# EAGLE design Carriage Board V2 (EAGLE 9.1.3)
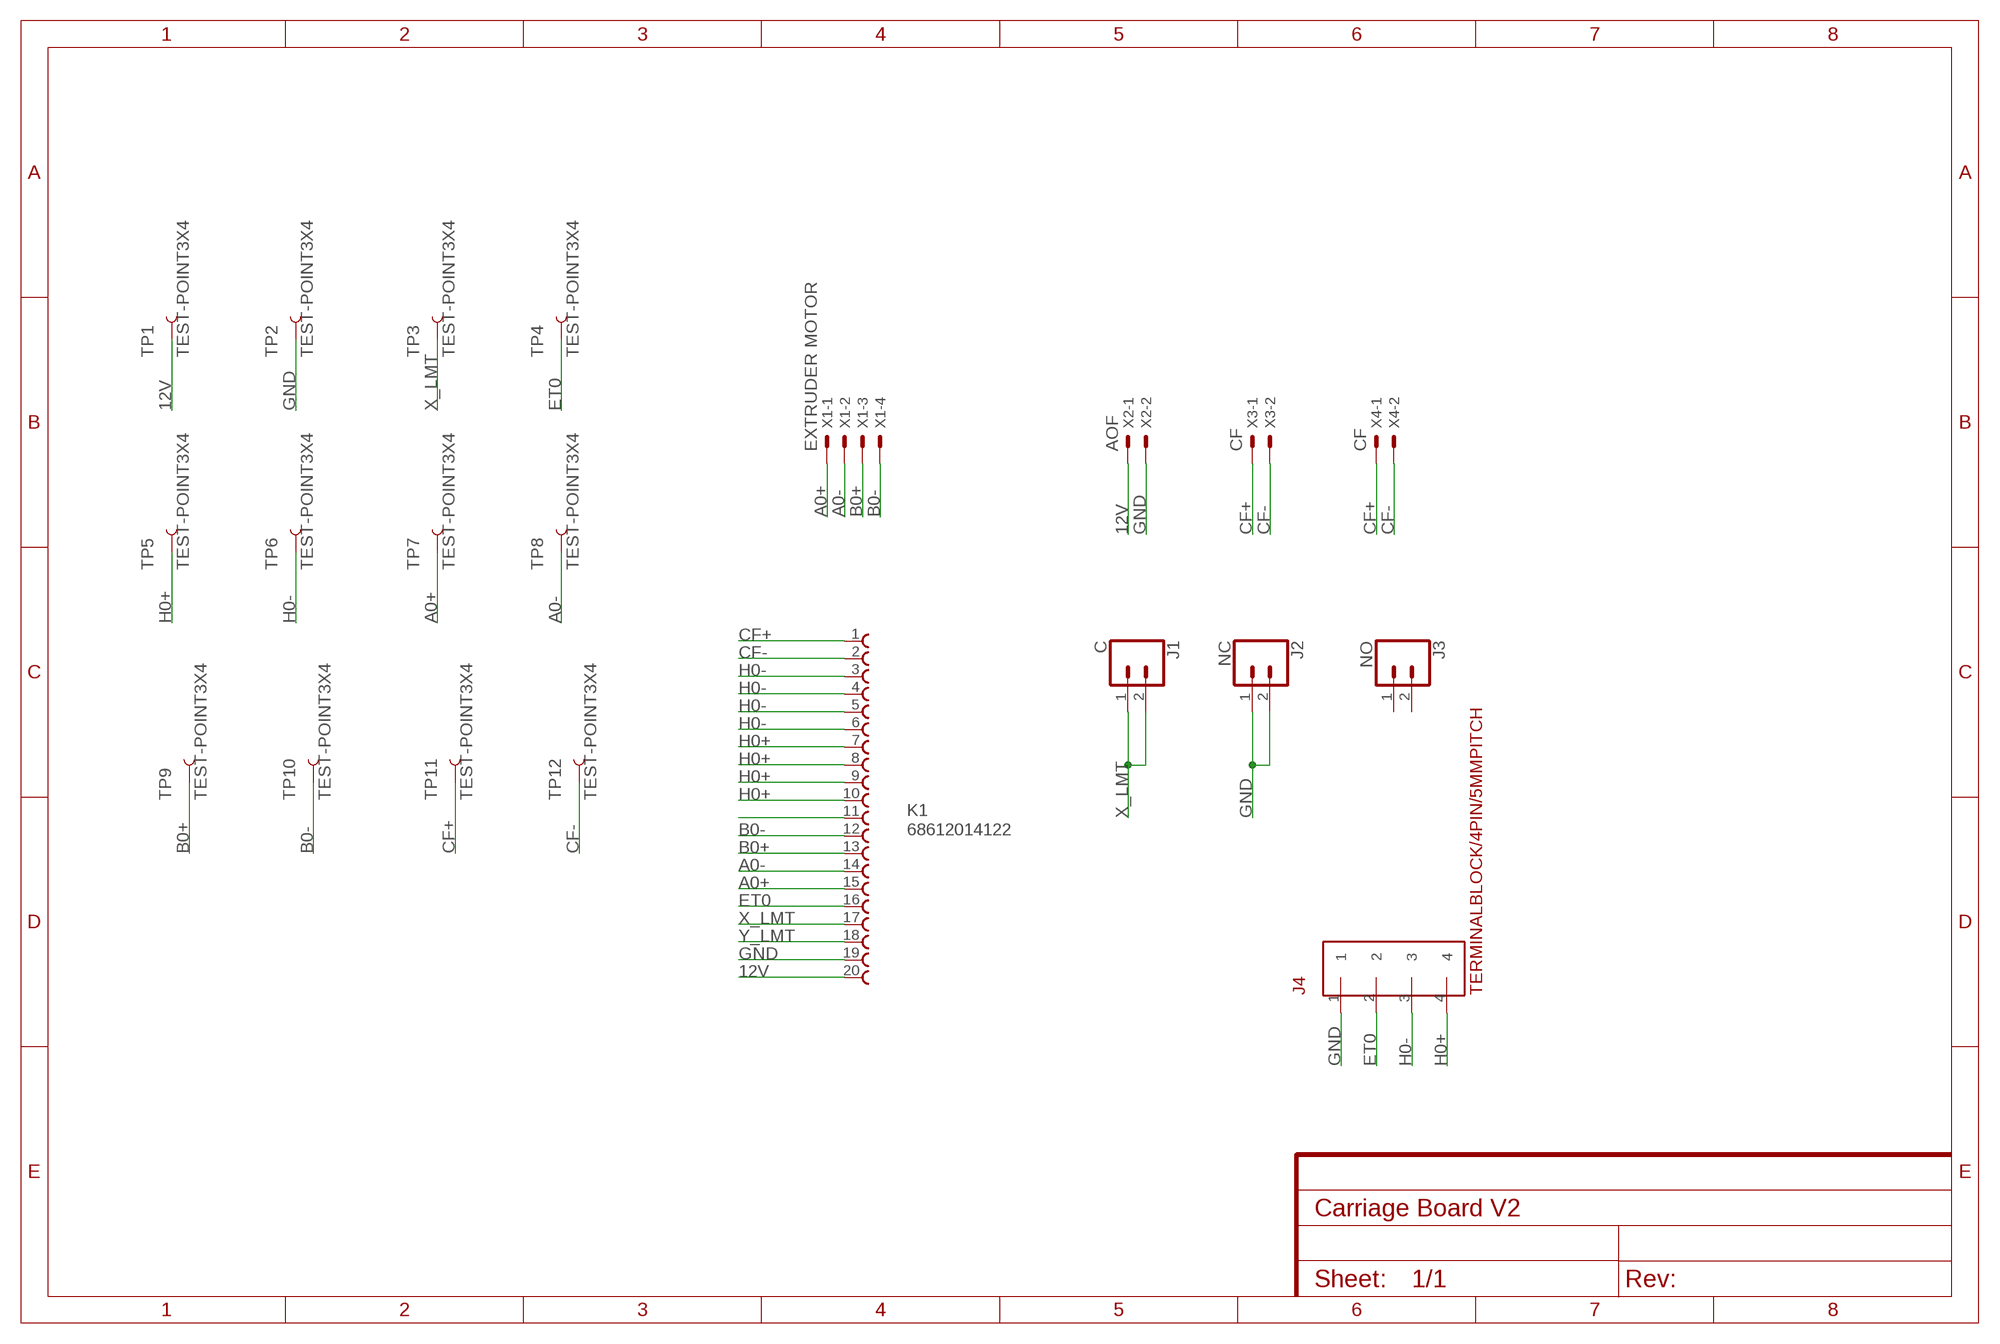
[diagram p0: schematic, sheet 1]

## Parts
J1  C  CONN_02  [1X02]
J2  NC  CONN_02  [1X02]
J3  NO  CONN_02  [1X02]
J4  TERMINALBLOCK/4PIN/5MMPITCH  [TERMINALBLOCK/TOYO/4PIN/5MMPITCH]
K1  68612014122  [68612014122]
TP1  TEST-POINT3X4  [PAD.03X.04]
TP2  TEST-POINT3X4  [PAD.03X.04]
TP3  TEST-POINT3X4  [PAD.03X.04]
TP4  TEST-POINT3X4  [PAD.03X.04]
TP5  TEST-POINT3X4  [PAD.03X.04]
TP6  TEST-POINT3X4  [PAD.03X.04]
TP7  TEST-POINT3X4  [PAD.03X.04]
TP8  TEST-POINT3X4  [PAD.03X.04]
TP9  TEST-POINT3X4  [PAD.03X.04]
TP10  TEST-POINT3X4  [PAD.03X.04]
TP11  TEST-POINT3X4  [PAD.03X.04]
TP12  TEST-POINT3X4  [PAD.03X.04]
X1  EXTRUDER MOTOR  JST-XH-04-PIN-LONG-PAD  [JST-XH-04-PACKAGE-LONG-PAD]
X2  AOF  JST-XH-02-PIN-LONG-PAD  [JST-XH-02-PACKAGE-LONG-PAD]
X3  CF  JST-XH-02-PIN-LONG-PAD  [JST-XH-02-PACKAGE-LONG-PAD]
X4  CF  JST-XH-02-PIN-LONG-PAD  [JST-XH-02-PACKAGE-LONG-PAD]

## Nets
12V: K1.20 TP1.P$1 X2.1
A0+: K1.15 TP7.P$1 X1.1
A0-: K1.14 TP8.P$1 X1.2
B0+: K1.13 TP9.P$1 X1.3
B0-: K1.12 TP10.P$1 X1.4
CF+: K1.1 TP11.P$1 X3.1 X4.1
CF-: K1.2 TP12.P$1 X3.2 X4.2
ET0: J4.2 K1.16 TP4.P$1
GND: J2.1 J2.2 J4.1 K1.19 TP2.P$1 X2.2
H0+: J4.4 K1.7 K1.8 K1.9 K1.10 TP5.P$1
H0-: J4.3 K1.3 K1.4 K1.5 K1.6 TP6.P$1
N$10: K1.11
X_LMT: J1.1 J1.2 K1.17 TP3.P$1
Y_LMT: K1.18
Unconnected: J3.1 J3.2

## Library data of the parts
J1-J3 = SparkFun-Connectors:CONN_02: Multi connection point. Often used as Generic Header-pin footprint for 0.1 inch spaced/style header connections On any of the 0.1 inch spaced packages, you can populate with these: Break Away Headers - Straight <https://www.sparkfun.com/products/116> (PRT-00116) Break Away Male Headers - Right Angle <https://www.sparkfun.com/products/553> (PRT-00553) Female Headers <https://www.sparkfun.com/products/115> (PRT-00115) Break Away Headers - Machine Pin <https://www.sparkfun.com/products/117> (PRT-00117) Break Away Female Headers - Swiss Machine Pin <https://www.sparkfun.com/products/743> (PRT-00743) For SCREWTERMINALS and SPRING TERMINALS visit here: Screw Terimnals on SparkFun.com <https://www.sparkfun.com/search/results?term=Screw+Terminals> (5mm/3.5mm/2.54mm spacing) This device is also useful as a general connection point to wire up your design to another part of your project. Our various solder wires solder well into these plated through hole pads. Hook-Up Wire - Assortment (Stranded, 22 AWG) <https://www.sparkfun.com/products/11375> (PRT-11375) Hook-Up Wire - Assortment (Solid Core, 22 AWG) <https://www.sparkfun.com/products/11367> (PRT-11367) View the entire wire category on our website here <https://www.sparkfun.com/categories/141> Special notes: Molex polarized connector foot print use with: PRT-08233 with associated crimp pins and housings. 2.54_SCREWTERM for use with PRT-10571. 3.5mm Screw Terminal footprints for PRT-08084 5mm Screw Terminal footprints for use with PRT-08432
J4 = FracktalWorks_Eagle_Library:TERMINALBLOCK/4PIN/5MMPITCH
K1 = Wurth_Elektronik_Electromechanic_FPC_Connectors_&_Flat_Flexible_Cable_rev15b:68612014122: WR-FPC 1.00mm SMT ZIF Horizontal Top Contact, 20 Pins=>Code : Con_FPC_ZIF_1.00_68612014122 <http://katalog.we-online.de/media/images/eican/Con_FPC_ZIF_1.00_6861xx14122_pf2.jpg> Details see: http://katalog.we-online.de/en/em/686_1xx_141_22 Created 2014-07-09, Karrer Zheng 2014 (C) Würth Elektronik
TP1-TP12 = SparkFun-Connectors:TEST-POINT: SparkFun Test Points Bare copper test points for troubleshooting or In-Circuit-Testing. These are used by our Production team for verifying production board runs using pogo-pins on test beds. SparkFun Products: SparkFun LSM9DS1 Breakout <https://www.sparkfun.com/products/13284> SparkFun PSOC <https://www.sparkfun.com/products/13714> SparkFun Load Cell Amplifier <https://www.sparkfun.com/products/13879>
X1 = Rembrandt Electronics - JST XH Connectors v1-0:JST-XH-04-PIN: JST XH Connector 2 Pin Wire to board connector. Pitch: 2,54 mm, (0.100") Number of pins: 4 Created by Rembrandt Electronics www.rembrandtelectronics.com
X2-X4 = Rembrandt Electronics - JST XH Connectors v1-0:JST-XH-02-PIN: JST XH Connector 2 Pin Wire to board connector. Pitch: 2,54 mm, (0.100") Number of pins: 2 Created by Rembrandt Electronics www.rembrandtelectronics.com

## Net classes
0 default: width 0.305 mm

## Board
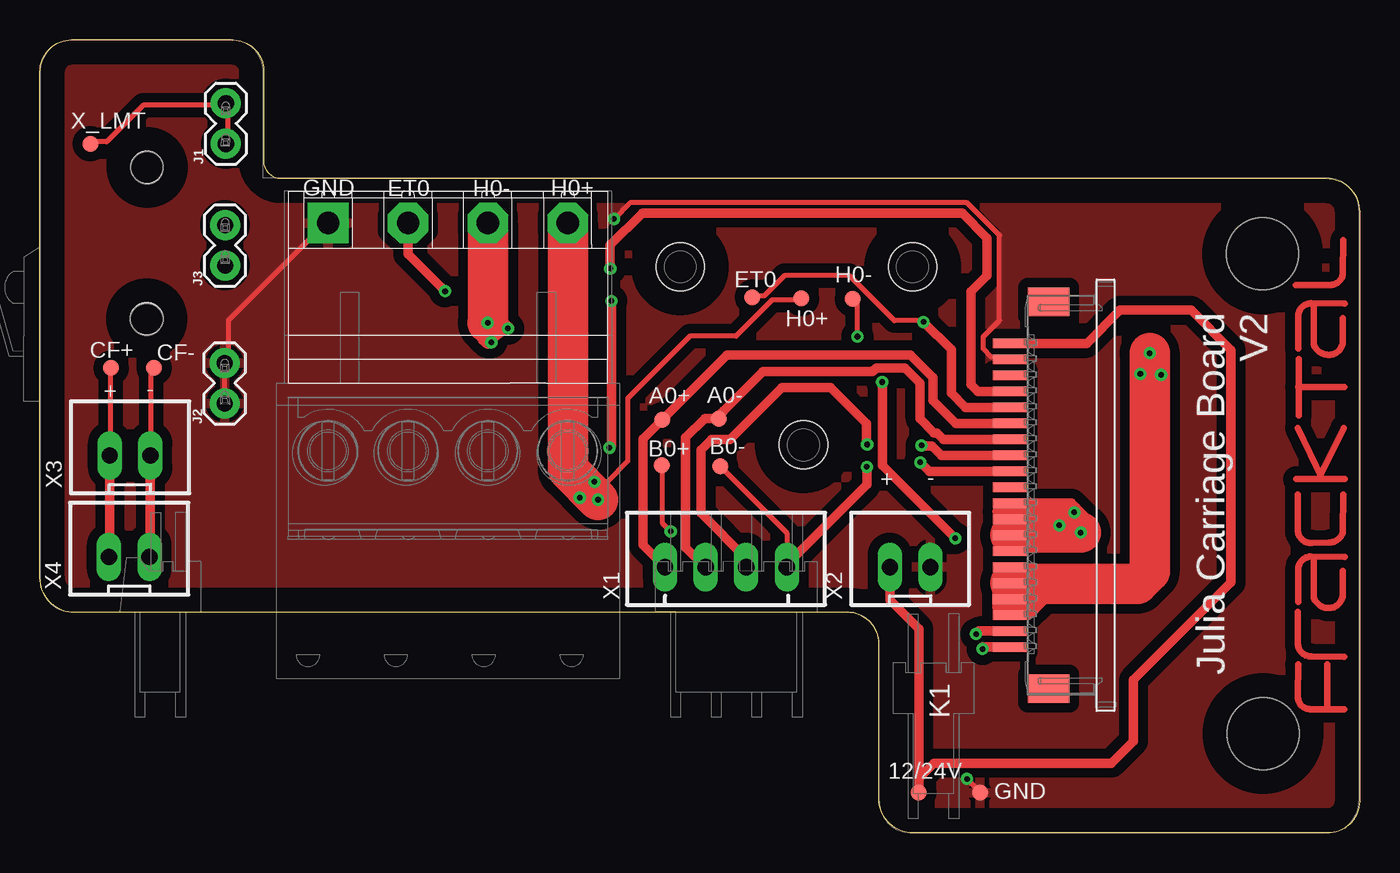
[diagram p1: board, top side]
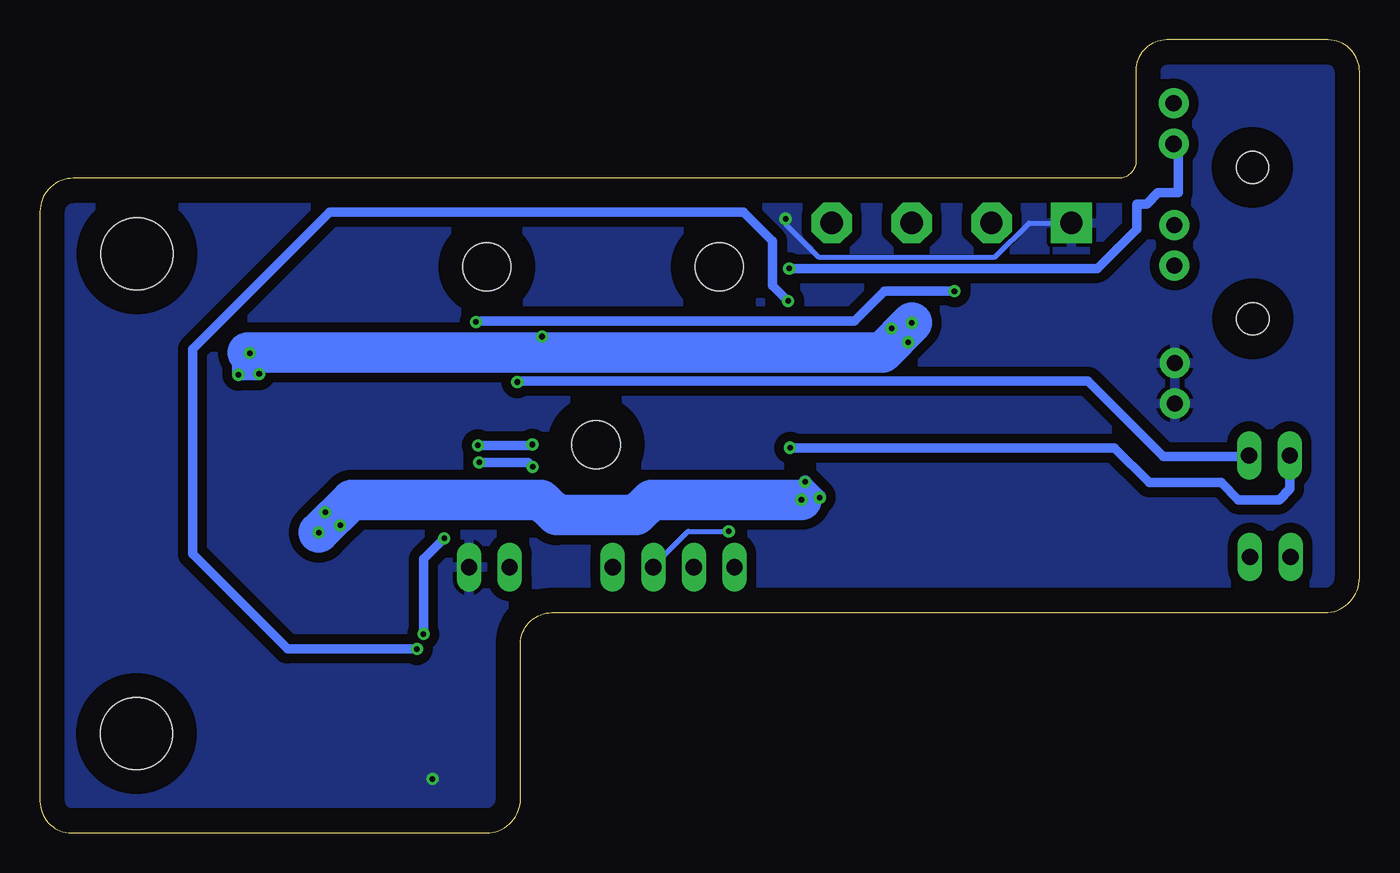
[diagram p2: board, bottom side, seen from below]

Size 82.58 x 49.63 mm. Coordinates in mm from the lower left corner, seen from the top.
Outline: 1.96,49.63 12.09,49.63 arc-90 14,47.7 14,42.06 arc90 15.09,40.97 80.49,40.97 arc-90 82.58,38.89 82.58,1.98 arc-90 80.59,0 54.64,0 arc-90 52.5,2.13 52.5,11.84 arc90 50.55,13.79 2.18,13.79 arc-90 0,15.98 0,47.65 arc-90 1.96,49.63
Copper layers (1*16): Top 0.035mm / dielectric 1.5mm / Bottom 0.035mm
Design rules "LionCircuits": minimum track width 8mil, minimum drill 0.35mm, track to track 8mil, track to pad 8mil, pad to pad 8mil, via to via 8mil, smd to smd 8mil, copper to edge 60mil, drill to drill 10mil, minimum pad ring 10mil, minimum via ring 8mil, stop-mask expansion 4mil, vias tented up to drill 0mil, thermal gap 10mil
Holes 3 mm at 40.06,35.43 54.61,35.43 47.78,24.31
Holes 2 mm at 6.71,41.66 6.68,32.18
Holes 4.5 mm at 76.5,36.25 76.53,6.22

### Footprints (pad centres in the part's own frame; a part is rotated, then mirrored left to right if it is on the bottom)
1X02 = drill 1.016 pad 1.88: 1 0,0; 2 2.54,0
TERMINALBLOCK/TOYO/4PIN/5MMPITCH = drill 1.4 pad 2.54 square: 1 0,0 | drill 1.4 pad 2.54 octagon: 2 5,0; 3 10,0; 4 15,0
68612014122 = smd 0.6 x 2.2: 1 -9.42,1.1; 2 -8.42,1.1; 3 -7.42,1.1; 4 -6.42,1.1; 5 -5.42,1.1; 6 -4.42,1.1; 7 -3.42,1.1; 8 -2.42,1.1; 9 -1.42,1.1; 10 -0.42,1.1; 11 0.58,1.1; 12 1.58,1.1; 13 2.58,1.1; 14 3.58,1.1; 15 4.58,1.1; 16 5.58,1.1; 17 6.58,1.1; 18 7.58,1.1; 19 8.58,1.1; 20 9.58,1.1 | smd 1.8 x 2.6: Z1 -12.02,-1.3; Z2 12.18,-1.3
PAD.03X.04 = smd 1.016 x 1.016: P$1 0,0
JST-XH-04-PACKAGE-LONG-PAD = drill 1.016 long: 1 -3.81,0; 2 -1.27,0; 3 1.27,0; 4 3.81,0
JST-XH-02-PACKAGE-LONG-PAD = drill 1.016 long: 1 -1.27,0; 2 1.27,0

### Placement (x,y rotation side)
J1  11.63,43.13 90 top
J2  11.56,26.87 90 top
J3  11.58,35.51 90 top
J4  18.03,38.18 0 top
K1  61.82,21.06 90 top
TP1  54.99,2.54 0 top
TP2  58.83,2.51 0 top
TP3  3.15,43.13 0 top
TP4  44.58,33.53 0 top
TP5  47.65,33.45 0 top
TP6  50.85,33.43 0 top
TP7  38.94,25.86 0 top
TP8  42.47,25.93 0 top
TP9  38.91,23.01 0 top
TP10  42.57,22.94 0 top
TP11  4.45,29.11 0 top
TP12  7.14,29.11 0 top
U$1  [FRACKTALLOGO]  81.71,19.74 90 top
X1  42.93,16.64 0 top
X2  54.46,16.64 0 top
X3  5.64,23.62 0 top
X4  5.59,17.27 0 top

### Tracks (layer width: path | path; a pad name or v marks a point on that pad's centre or on a via)
12V
  Top 0.61: K1.20 65.51,30.64 67.59,32.72 72.03,32.72 74.52,30.23 74.52,15.67 68.43,9.58 68.43,5.74 67.06,4.37 55.96,4.37 54.99,3.4 TP1.P$1 54.99,12.78 53.19,14.59 X2.1
A0+
  Top 0.61: K1.15 57.32,25.64 55.88,27.08 55.88,28.51 54.46,29.92 43,29.92 TP7.P$1 37.74,24.66 37.74,18.01 X1.1
A0-
  Top 0.305: 42.68,26.33 42.77,26.24 42.77,26.42
  Top 0.61: K1.14 56.55,24.64 56.14,25.04 55.96,25.04 55.07,25.93 55.07,28.17 54.13,29.11 52.34,29.11 52.11,28.88 45.24,28.88 42.77,26.42 | 42.68,26.33 42.47,26.11 TP8.P$1 41.61,25.93 40.41,24.74 40.41,17.88 X1.2
B0+  (via drill 0.35)
  Top 0.305: v39.47,18.87 38.96,19.38 38.96,22.94 TP9.P$1
  Top 0.61: K1.13 56.4,23.64 55.8,24.23 55.19,24.23 v55.17,24.26 | v51.77,24.31 51.71,24.36 51.71,25.63 49.46,27.89 46.43,27.89 43.17,24.64 42.01,24.64 41.35,23.98 41.35,20.02 44.2,17.17 X1.3
  Bottom 0.305: v39.47,18.87 42.01,18.87 44.04,16.84 X1.3
  Bottom 0.61: v55.17,24.26 51.82,24.26 v51.77,24.31
B0-  (via drill 0.35)
  Top 0.305: TP10.P$1 46.74,18.77 X1.4
  Top 0.61: K1.12 55.65,22.64 v55.09,23.19 | X1.4 46.74,16.82 51.74,21.82 v51.74,22.91
  Bottom 0.61: v55.09,23.19 52.02,23.19 v51.74,22.91
CF+  (via drill 0.35)
  Top 0.305: TP11.P$1 4.42,29.03 4.42,23.7 X3.1
  Top 0.61: X3.1 4.37,17.32 X4.1 | K1.1 58.98,11.64 v58.98,11.51 | v35.76,33.3 35.76,24.23 v35.64,24.1
  Bottom 0.61: X3.1 4.37,21.51 5.03,20.85 7.59,20.85 8.66,21.92 13.16,21.92 15.35,24.1 v35.64,24.1 | v58.98,11.51 67.08,11.51 73.02,17.45 73.02,30.28 64.44,38.86 38.55,38.86 36.73,37.04 36.73,34.26 v35.76,33.3
CF-  (via drill 0.35)
  Top 0.305: TP12.P$1 6.96,29.03 6.96,23.7 X3.2
  Top 0.61: K1.2 58.76,12.64 v58.57,12.45 | v57.28,18.44 52.7,23.01 v52.7,28.22 | X3.2 6.91,17.32 X4.2
  Bottom 0.61: v58.57,12.45 58.57,17.15 v57.28,18.44 | X3.2 6.96,23.57 12.29,23.57 17,28.27 52.65,28.27 v52.7,28.22
ET0  (via drill 0.35)
  Top 0.305: TP4.P$1 44.81,33.6 45.31,33.6 46.58,34.87 50.65,34.87 53.47,32.06 55.37,32.06 v55.3,31.98
  Top 0.61: J4.2 23.03,36.22 v25.35,33.91 | v55.3,31.98 57.02,30.25 57.02,27.53 57.92,26.64 K1.16
  Bottom 0.61: v25.35,33.91 29.72,33.91 31.6,32.03 55.24,32.03 v55.3,31.98
GND  (via drill 0.35)
  Top 0.305: J2.1 11.53,27 11.53,29.29 J2.2 11.79,29.54 11.79,32.08 17.88,38.18 J4.1 | v58.01,3.38 58.78,2.62 TP2.P$1 | v35.92,38.43 36.93,39.45 58.01,39.45 60.05,37.41 60.05,32.08 59.03,31.06 59.03,30.3 59.54,29.79 60.55,29.79 K1.19
  Bottom 0.305: J4.1 20.68,38.18 22.81,36.04 33.86,36.04 35.92,38.1 v35.92,38.43
  pour Bottom (isolate 0.61): 1.88,49.68 12.17,49.68 arc-90 14.1,47.75 14.1,42.47 arc90 15.65,40.92 79.63,40.92 arc-90 82.65,37.9 82.65,2.11 arc-90 80.42,-0.13 54.81,-0.13 arc-90 52.43,2.26 52.43,11.35 arc90 50.04,13.74 2.64,13.74 arc-90 0,16.38 0,47.75 arc-90 1.88,49.63
  pour Top (isolate 0.61): 1.7,49.66 11.73,49.66 arc-90 14.1,47.29 14.1,42.77 arc90 16.05,40.82 79.48,40.82 arc-90 82.73,37.57 82.73,2.18 arc-90 80.37,-0.18 55.27,-0.18 arc-90 52.32,2.77 52.32,11.15 arc90 49.78,13.69 3.18,13.69 arc-90 0,16.87 0,47.96 arc-90
H0+  (via drill 0.35)
  Top 0.305: TP5.P$1 47.6,33.35 45.82,33.35 43.56,31.09 40.67,31.09 36.78,27.2 36.78,23.27 35.48,21.97 v34.7,21.97
  Top 0.61: 64.83,20.36 64.55,20.64 K1.10 60.72,20.19 | 64.83,20.36 65.94,19.25 65.48,18.8 v65.13,18.8 | 60.72,20.19 K1.9 | 60.72,20.19 64.67,20.19 64.83,20.36 | 60.72,20.19 59.97,20.19 59.89,20.12 60.72,19.29 K1.7
  Top 2.54: v34.92,20.85 33.03,22.74 J4.4 | v65.13,18.8 60.88,18.8 K1.8
  Bottom 0.813: v65.13,18.8 65.13,19.66 v64.72,20.07 63.91,19.25 v63.78,19.25 | v33.78,20.98 33.78,21.06 v34.7,21.97 34.7,21.08 v34.92,20.85
  Bottom 2.54: v65.13,18.8 63.07,20.85 51.23,20.85 50.26,19.89 45.27,19.89 44.3,20.85 v34.92,20.85
H0-  (via drill 0.35)
  Top 0.305: v51.16,31.06 51.16,33.26 TP6.P$1
  Top 0.61: 62.26,14 61.9,13.64 K1.3 60.72,14.15 | 62.26,14 63.86,15.6 | 60.72,14.15 K1.4 | 60.72,14.15 62.1,14.15 62.13,14.12 | 62.26,14 62.13,14.12 | 62.13,14.12 59.87,14.12 59.87,15.78 K1.6
  Top 0.813: v28.02,31.93 28.93,31.93 v29.29,31.57 28.32,31.57 27.74,30.99 28.02,30.71 v28.24,30.71
  Top 2.54: J4.3 28.03,31.95 v28.02,31.93 | v69.44,30.02 69.44,16.36 68.68,15.6 63.86,15.6 60.76,15.6 K1.5
  Bottom 0.305: v51.16,31.06 51.16,30.07
  Bottom 0.813: v68.86,28.73 70.1,28.73 v70.15,28.68 70.15,29.31 v69.44,30.02
  Bottom 2.54: v28.02,31.93 29.87,30.07 51.16,30.07 69.57,30.07 69.52,30.02 v69.44,30.02
X_LMT  (via drill 0.35)
  Top 0.305: TP3.P$1 3.15,43.26 4.17,43.26 6.45,45.54 11.53,45.54 J1.2 11.79,45.54 11.79,43.26 J1.1
  Top 0.61: K1.17 58.7,27.64 58.27,28.07 58.27,33.88 59.26,34.87 59.26,37.24 57.71,38.79 37.69,38.79 35.69,36.78 v35.69,35.33
  Bottom 0.61: v35.69,35.33 16.41,35.33 13.94,37.8 13.94,39.37 13.32,39.37 12.61,40.08 11.35,40.08 11.35,42.85 J1.1

### Text on the board
tPlace: + | -
tNames: X_LMT | GND | ET0 | H0- | H0+ | ET0 | H0- | Julia Carriage Board / V2 | H0+ | CF+ | CF- | A0+ | A0- | B0+ | B0- | + | - | 12/24V | GND